# EAGLE design esp-01_lite2_us (EAGLE 8.7.0)
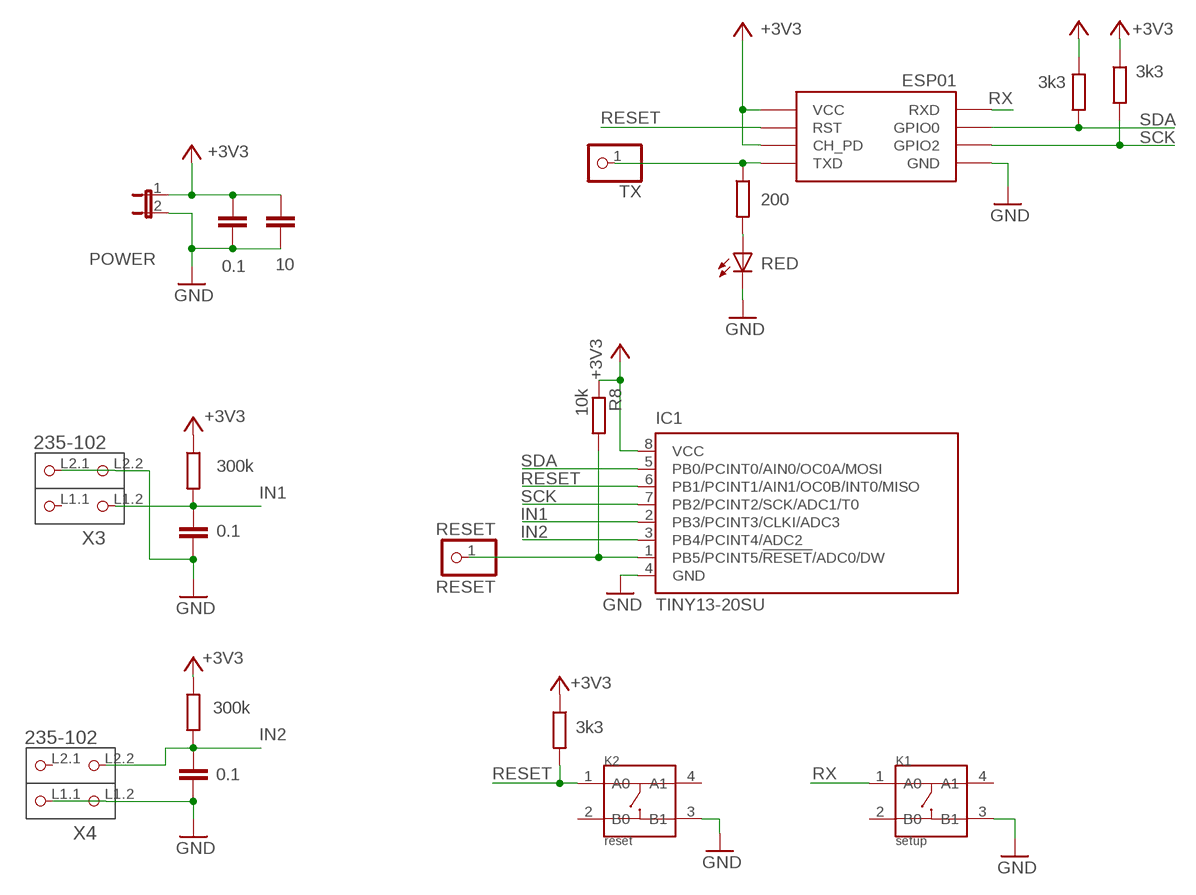
[diagram p0: schematic, sheet 1]

## Parts
C1  0.1  C-EUC0805  [C0805]
C2  0.1  C-EUC0805  [C0805]
C3  0.1  C-EUC0805  [C0805]
C4  10  C-EU025-024X044  [C025-024X044]
IC1  TINY13-20SU  [8S2]
JP2  POWER  JP1E  [JP1]
K1  setup  DIP-BUTTON-4P  [SW4-6.0X6.0X5.0MM]
K2  reset  DIP-BUTTON-4P  [SW4-6.0X6.0X5.0MM]
LED1  RED  LEDSML0805  [SML0805]
R2  3k3  R-EU_R0805  [R0805]
R3  3k3  R-EU_0207/5V  [0207/5V]
R4  200  R-EU_0207/5V  [0207/5V]
R5  3k3  R-EU_R0805  [R0805]
R8  10k  R-EU_R0805  [R0805]
R10  300k  R-EU_R0805  [R0805]
R11  300k  R-EU_0207/7  [0207/7]
RESET  RESET  PINHD-1X1  [1X01]
TX  TX  PINHD-1X1  [1X01]
U$1  ESP01  [ESP01]
X3  235-102  [P-235-102]
X4  235-102  [P-235-102]

## Nets
+3V3: C3.1 C4.1 IC1.8(VCC) JP2.1 R2.1 R3.1 R5.1 R8.1 R10.1 R11.1 U$1.CH_PD U$1.VCC
GND: C1.2 C2.1 C3.2 C4.2 IC1.4(GND) JP2.2 K1.3(B1) K2.3(B1) LED1.C U$1.GND X3.L2.1(P2.1) X3.L2.2(P2.2) X4.L1.1(P1.1) X4.L1.2(P1.2)
IN1: C1.1 IC1.2(PB3/PCINT3/CLKI/ADC3) R10.2 X3.L1.2(P1.2)
IN2: C2.2 IC1.3(PB4/PCINT4/ADC2) R11.2 X4.L2.2(P2.2)
N$3: R4.1 TX.1 U$1.TX(TXD)
N$12: LED1.A R4.2
N$13: IC1.1(PB5/PCINT5/!RESET!/ADC0/DW) R8.2 RESET.1
RESET: IC1.6(PB1/PCINT1/AIN1/OC0B/INT0/MISO) K2.1(A0) R5.2 U$1.RST
RX: K1.1(A0) U$1.RX(RXD)
SCK: IC1.7(PB2/PCINT2/SCK/ADC1/T0) R2.2 U$1.GPIO2
SDA: IC1.5(PB0/PCINT0/AIN0/OC0A/MOSI) R3.2 U$1.GPIO0
Unconnected: K1.2(B0) K1.4(A1) K2.2(B0) K2.4(A1) X3.L1.1(P1.1) X4.L2.1(P2.1)

## Library data of the parts
C1-C3 = rcl:C-EU: CAPACITOR, European symbol; MKF: 0.1
C4 = resistor:C-EU: CAPACITOR, European symbol; MKF: 0.1
IC1 = atmel:TINY13: 8-bit AVR Microcontroller with 1K Bytes In-System Programmable Flash Source: http://www.atmel.com/dyn/resources/prod_documents/2535S.pdf; MPN: ATTINY13-20SU; OC_FARNELL: 9171568; OC_NEWARK: 96K6522
JP2 = jumper:JP1E: JUMPER
K1 K2 = Seeed-OPL-Button:DIP-BUTTON-4P: 311020024; MPN: TS-1109; VALUE: TS-1109
LED1 = led:LED: LED OSRAM: - CHIPLED LG R971, LG N971, LY N971, LG Q971, LY Q971, LO R971, LY R971 LH N974, LH R974 LS Q976, LO Q976, LY Q976 LO Q996 - Hyper CHIPLED LW Q18S LB Q993, LB Q99A, LB R99A - SideLED LS A670, LO A670, LY A670, LG A670, LP A670 LB A673, LV A673, LT A673, LW A673 LH A674 LY A675 LS A676, LA A676, LO A676, LY A676, LW A676 LS A679, LY A679, LG A679 - Hyper Micro SIDELED® LS Y876, LA Y876, LO Y876, LY Y876 LT Y87S - SmartLED LW L88C, LW L88S LB L89C, LB L89S, LG L890 LS L89K, LO L89K, LY L89K LS L896, LA L896, LO L896, LY L896 - TOPLED LS T670, LO T670, LY T670, LG T670, LP T670 LSG T670, LSP T670, LSY T670, LOP T670, LYG T670 LG T671, LOG T671, LSG T671 LB T673, LV T673, LT T673, LW T673 LH T674 LS T676, LA T676, LO T676, LY T676, LB T676, LH T676, LSB T676, LW T676 LB T67C, LV T67C, LT T67C, LS T67K, LO T67K, LY T67K, LW E67C LS E67B, LA E67B, LO E67B, LY E67B, LB E67C, LV E67C, LT E67C LW T67C LS T679, LY T679, LG T679 LS T770, LO T770, LY T770, LG T770, LP T770 LB T773, LV T773, LT T773, LW T773 LH T774 LS E675, LA E675, LY E675, LS T675 LS T776, LA T776, LO T776, LY T776, LB T776 LHGB T686 LT T68C, LB T68C - Hyper Mini TOPLED® LB M676 - Mini TOPLED Santana® LG M470 LS M47K, LO M47K, LY M47K Source: http://www.osram.convergy.de LUXEON: - LUMILED® LXK2-PW12-R00, LXK2-PW12-S00, LXK2-PW14-U00, LXK2-PW14-V00 LXK2-PM12-R00, LXK2-PM12-S00, LXK2-PM14-U00 LXK2-PE12-Q00, LXK2-PE12-R00, LXK2-PE12-S00, LXK2-PE14-T00, LXK2-PE14-U00 LXK2-PB12-K00, LXK2-PB12-L00, LXK2-PB12-M00, LXK2-PB14-N00, LXK2-PB14-P00, LXK2-PB14-Q00 LXK2-PR12-L00, LXK2-PR12-M00, LXK2-PR14-Q00, LXK2-PR14-R00 LXK2-PD12-Q00, LXK2-PD12-R00, LXK2-PD12-S00 LXK2-PH12-R00, LXK2-PH12-S00 LXK2-PL12-P00, LXK2-PL12-Q00, LXK2-PL12-R00 Source: www.luxeon.com KINGBRIGHT: KA-3528ASYC Source: www.kingbright.com
R2 R5 R8 R10 = rcl:R-EU_: RESISTOR, European symbol; OM: 3k6
R3 R11 = resistor:R-EU_: RESISTOR, European symbol; OM: 3k6
R4 = resistor:R-EU_: RESISTOR, European symbol; OM: 200
RESET TX = pinhead:PINHD-1X1: PIN HEADER
U$1 = esp8266modules:ESP01: ESP8266 Wifi module 01
X3 X4 = con-wago_235:235-102: Serie 235, 1-Leiter-Klemmenleiste für Leiterplatten 2 Lötstifte/Pol / Series 235, 1-conductor PCB terminal strip 2 solder pins/pole Polzahl / Pole No.: 2 Rastermaß / Pitch: 3.81 - 3.81 mm Bemessungsspannung / Rated Voltage: 320 V Nennstrom / Nominal Current: 17.5 A Leiterquerschnitt / Conductor Size: 0.5 - 1.5 mm2 Anschlusstechnik / Connection Technology: PUSH WIRE® Lötstiftlänge: / Solder Pin Length: 3.6 mm Leitereinführung (zur Platine) / Conductor entry angle (to PCB): 0 ° Farbe / Color: orange / orange Stand: 01.01.2014. Die jeweils aktuellen Daten zu diesem Artikel finden Sie in unserem Produktkatalog, den Sie unter www.wago.com einsehen können. As of: 01/01/2014. Please find the newest data for this article in our product catalogue, which can be viewed under www.wago.com.

## Board
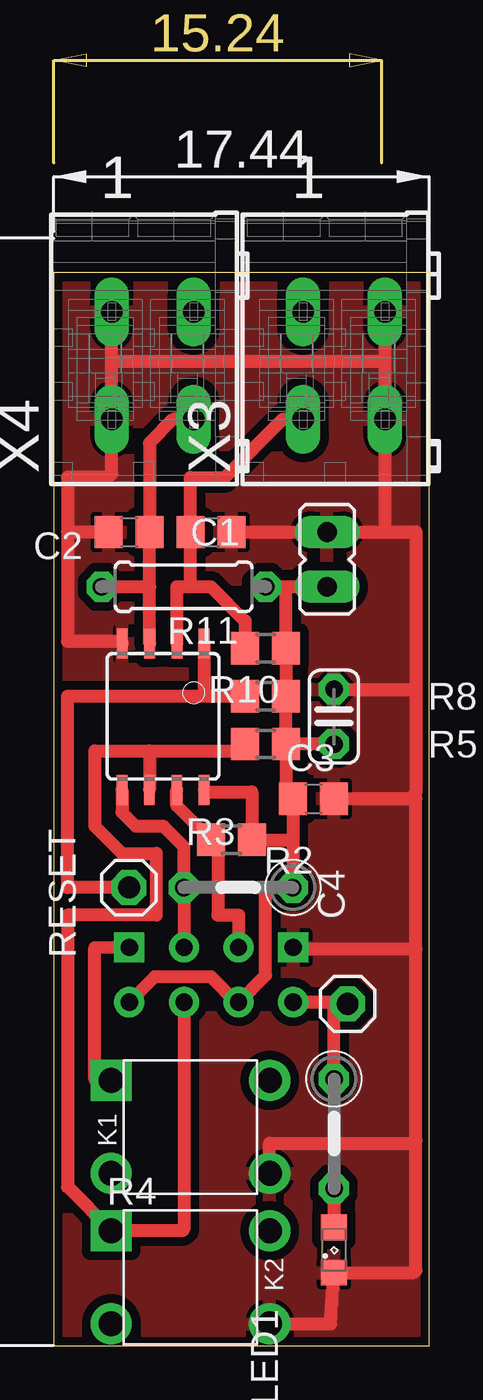
[diagram p1: board, top side]
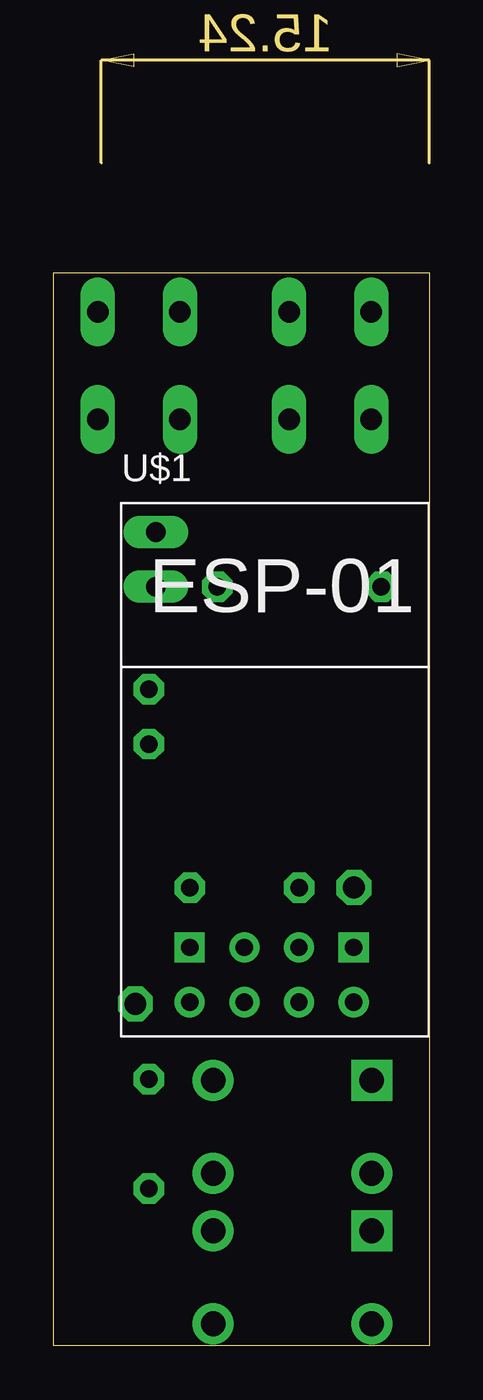
[diagram p2: board, bottom side, seen from below]

Size 17.44 x 49.84 mm. Coordinates in mm from the lower left corner, seen from the top.
Outline: 0,0 17.44,0 17.44,49.84 0,49.84 0,0
Copper layers 1: Top 0.018mm
Design rules "eC_1Layer_PClass6_BaseCopperO35_eCDefault *": minimum track width 0.3mm, minimum drill 0.5mm, track to track 0.3mm, track to pad 0.15mm, pad to pad 0.15mm, via to via 0.15mm, smd to smd 0mil, copper to edge 0.25mm, drill to drill 0.35mm, minimum pad ring 0.3mm, minimum via ring 0.3mm, stop-mask expansion 0mil, vias tented up to drill 0.45mm, thermal gap 0.2mm

### Footprints (pad centres in the part's own frame; a part is rotated, then mirrored left to right if it is on the bottom)
C0805 = smd 1.3 x 1.5: 1 -0.95,0; 2 0.95,0
C025-024X044 = drill 0.813 octagon: 1 -1.27,0; 2 1.27,0
8S2 = smd 0.5 x 1.4: 1 -1.905,-3.404; 2 -0.645,-3.404; 3 0.625,-3.404; 4 1.895,-3.404; 5 1.905,3.404; 6 0.635,3.404; 7 -0.635,3.404; 8 -1.905,3.404
JP1 = drill 0.914 long: 1 0,-1.27; 2 0,1.27
SW4-6.0X6.0X5.0MM = drill 1.143 pad 1.905 square: 1 -3.683,2.159 | drill 1.143 pad 1.905: 2 -3.683,-2.159; 3 3.683,-2.159; 4 3.683,2.159
SML0805 = smd 1.2 x 1.2: A 1.05,0; C -1.05,0
R0805 = smd 1.3 x 1.5: 1 -0.95,0; 2 0.95,0
0207/5V = drill 0.813 octagon: 1 -2.54,0; 2 2.54,0
0207/7 = drill 0.813 octagon: 1 -3.81,0; 2 3.81,0
1X01 = drill 1.016 octagon: 1 0,0
ESP01 = drill 0.8: CH_PD -1.285,-8.178; GPIO0 1.255,-5.638; GPIO2 -1.285,-5.638; RST 1.255,-8.178; TX -3.825,-8.178; VCC 3.795,-8.178 | drill 0.8 square: GND -3.825,-5.638; RX 3.795,-5.638
P-235-102 = drill 1 long: L1.1 1.662,1.75; L1.2 -3.338,1.75; L2.1 1.662,-2.06; L2.2 -3.338,-2.06

### Placement (x,y rotation side)
C1  7.3,37.78 0 top
C2  3.49,37.78 0 top
C3  12.06,25.4 0 top
C4  13.02,29.21 90 top
IC1  5.08,29.21 180 top
JP2  12.7,36.51 0 top
K1  6.35,10.16 0 top
K2  6.35,3.17 0 top
LED1  13.02,4.45 90 top
R2  8.26,23.5 180 top
R3  8.57,21.27 180 top
R4  13.02,9.84 270 top
R5  9.84,27.94 180 top
R8  9.84,30.16 180 top
R10  9.84,32.38 180 top
R11  6.03,35.24 180 top
RESET  3.49,21.27 0 top
TX  13.65,15.88 0 top
U$1  7.3,24.13 0 bottom
X3  13.34,46.35 90 top
X4  4.45,46.35 90 top

### Tracks (layer width: path | path; a pad name or v marks a point on that pad's centre or on a via)
+3V3
  Top 0.61: R5.1 R8.1 R10.1 10.79,35.24 | IC1.8 7.07,25.72 9.21,25.72 R2.1 11.12,23.5 | R5.1 10.79,25.41 C3.1 11.12,23.5 | 11.12,23.5 R3.1 | R3.1 | U$1.VCC 4.7,17.14 7.3,17.14 8.49,15.95 U$1.CH_PD 9.84,17.21 9.84,21.27 9.85,21.27 R3.1 | C4.1 R5.1 | R11.1 10.79,35.24 | 10.79,35.24 JP2.1
GND
  Top 0.61: 16.83,9.53 16.83,3.49 16.73,3.4 LED1.C 12.86,1.02 K2.3 | 16.83,9.53 16.83,18.41 | 16.83,18.41 16.83,25.4 | 16.83,25.4 16.83,25.72 | 16.73,25.5 16.83,25.72 | IC1.4 3.1,32.7 0.64,32.7 0.64,37.78 | 0.64,37.78 0.64,40.32 2.54,40.32 2.69,40.48 X4.L1.2 2.69,45.72 | 2.69,45.72 X4.L1.1 | X3.L2.1 15.39,45.72 | 15.39,45.72 X3.L2.2 15.39,37.94 15.24,37.78 | 2.69,45.72 15.39,45.72 | C2.1 0.64,37.78 | 15.24,37.78 16.83,37.78 16.83,30.48 | 16.83,30.48 16.83,25.72 | K1.3 10.03,9.4 16.7,9.4 16.83,9.53 | C3.2 16.83,25.4 | U$1.GND 11.21,18.41 16.83,18.41 | C4.2 16.83,30.48 | C1.2 JP2.2 15.24,37.78
  pour Top (isolate 0.406): 17.46,0 17.14,49.85 0.32,49.85 0,0.58 arc45 0.19,0.13 0.32,0
IN1
  Top 0.61: X3.L1.2 10.63,43.02 7.94,40.32 6.35,40.32 C1.1 6.35,36.52 6.36,35.25 5.72,35.24 | IC1.2 5.72,35.24 | 5.72,35.24 7.3,35.24 8.89,33.66 R10.2
IN2
  Top 0.61: X4.L2.2 5.55,43.02 4.45,41.91 C2.2 4.46,37.77 4.46,35.24 | IC1.3 4.46,35.24 | R11.2 4.46,35.24
N$3
  Top 0.61: 11.21,15.88 U$1.TX 13.02,15.95 | TX.1 13.57,15.95 13.02,15.95 | R4.1 13.02,15.95
N$12
  Top 0.61: R4.2 LED1.A
N$13
  Top 0.61: 6.99,30.16 0.64,30.16 0.64,21.27 RESET.1 | 6.99,30.16 R8.2 | IC1.1 6.99,30.16
RESET
  Top 0.61: U$1.RST 6.05,5.41 5.97,5.33 K2.1 0.64,7.37 0.64,20 4.76,20 4.76,22.86 3.17,22.86 1.91,24.13 1.91,27.62 4.45,27.62 | 4.45,27.62 IC1.6 | 4.45,27.62 8.57,27.62 R5.2
RX
  Top 0.61: U$1.RX 1.91,18.48 1.91,12.38 2.29,12.32 K1.1
SCK
  Top 0.61: U$1.GPIO2 8.59,19.99 8.57,20 7.62,20 7.62,23.18 R2.2 5.71,25.09 IC1.7
SDA
  Top 0.61: U$1.GPIO0 6.05,21.27 R3.2 6.03,23.18 5.08,24.13 3.81,24.13 3.17,24.77 IC1.5